# Altium schematic sheet P17_USB 3.0 HOST.SchDoc
size 420 x 297 mm
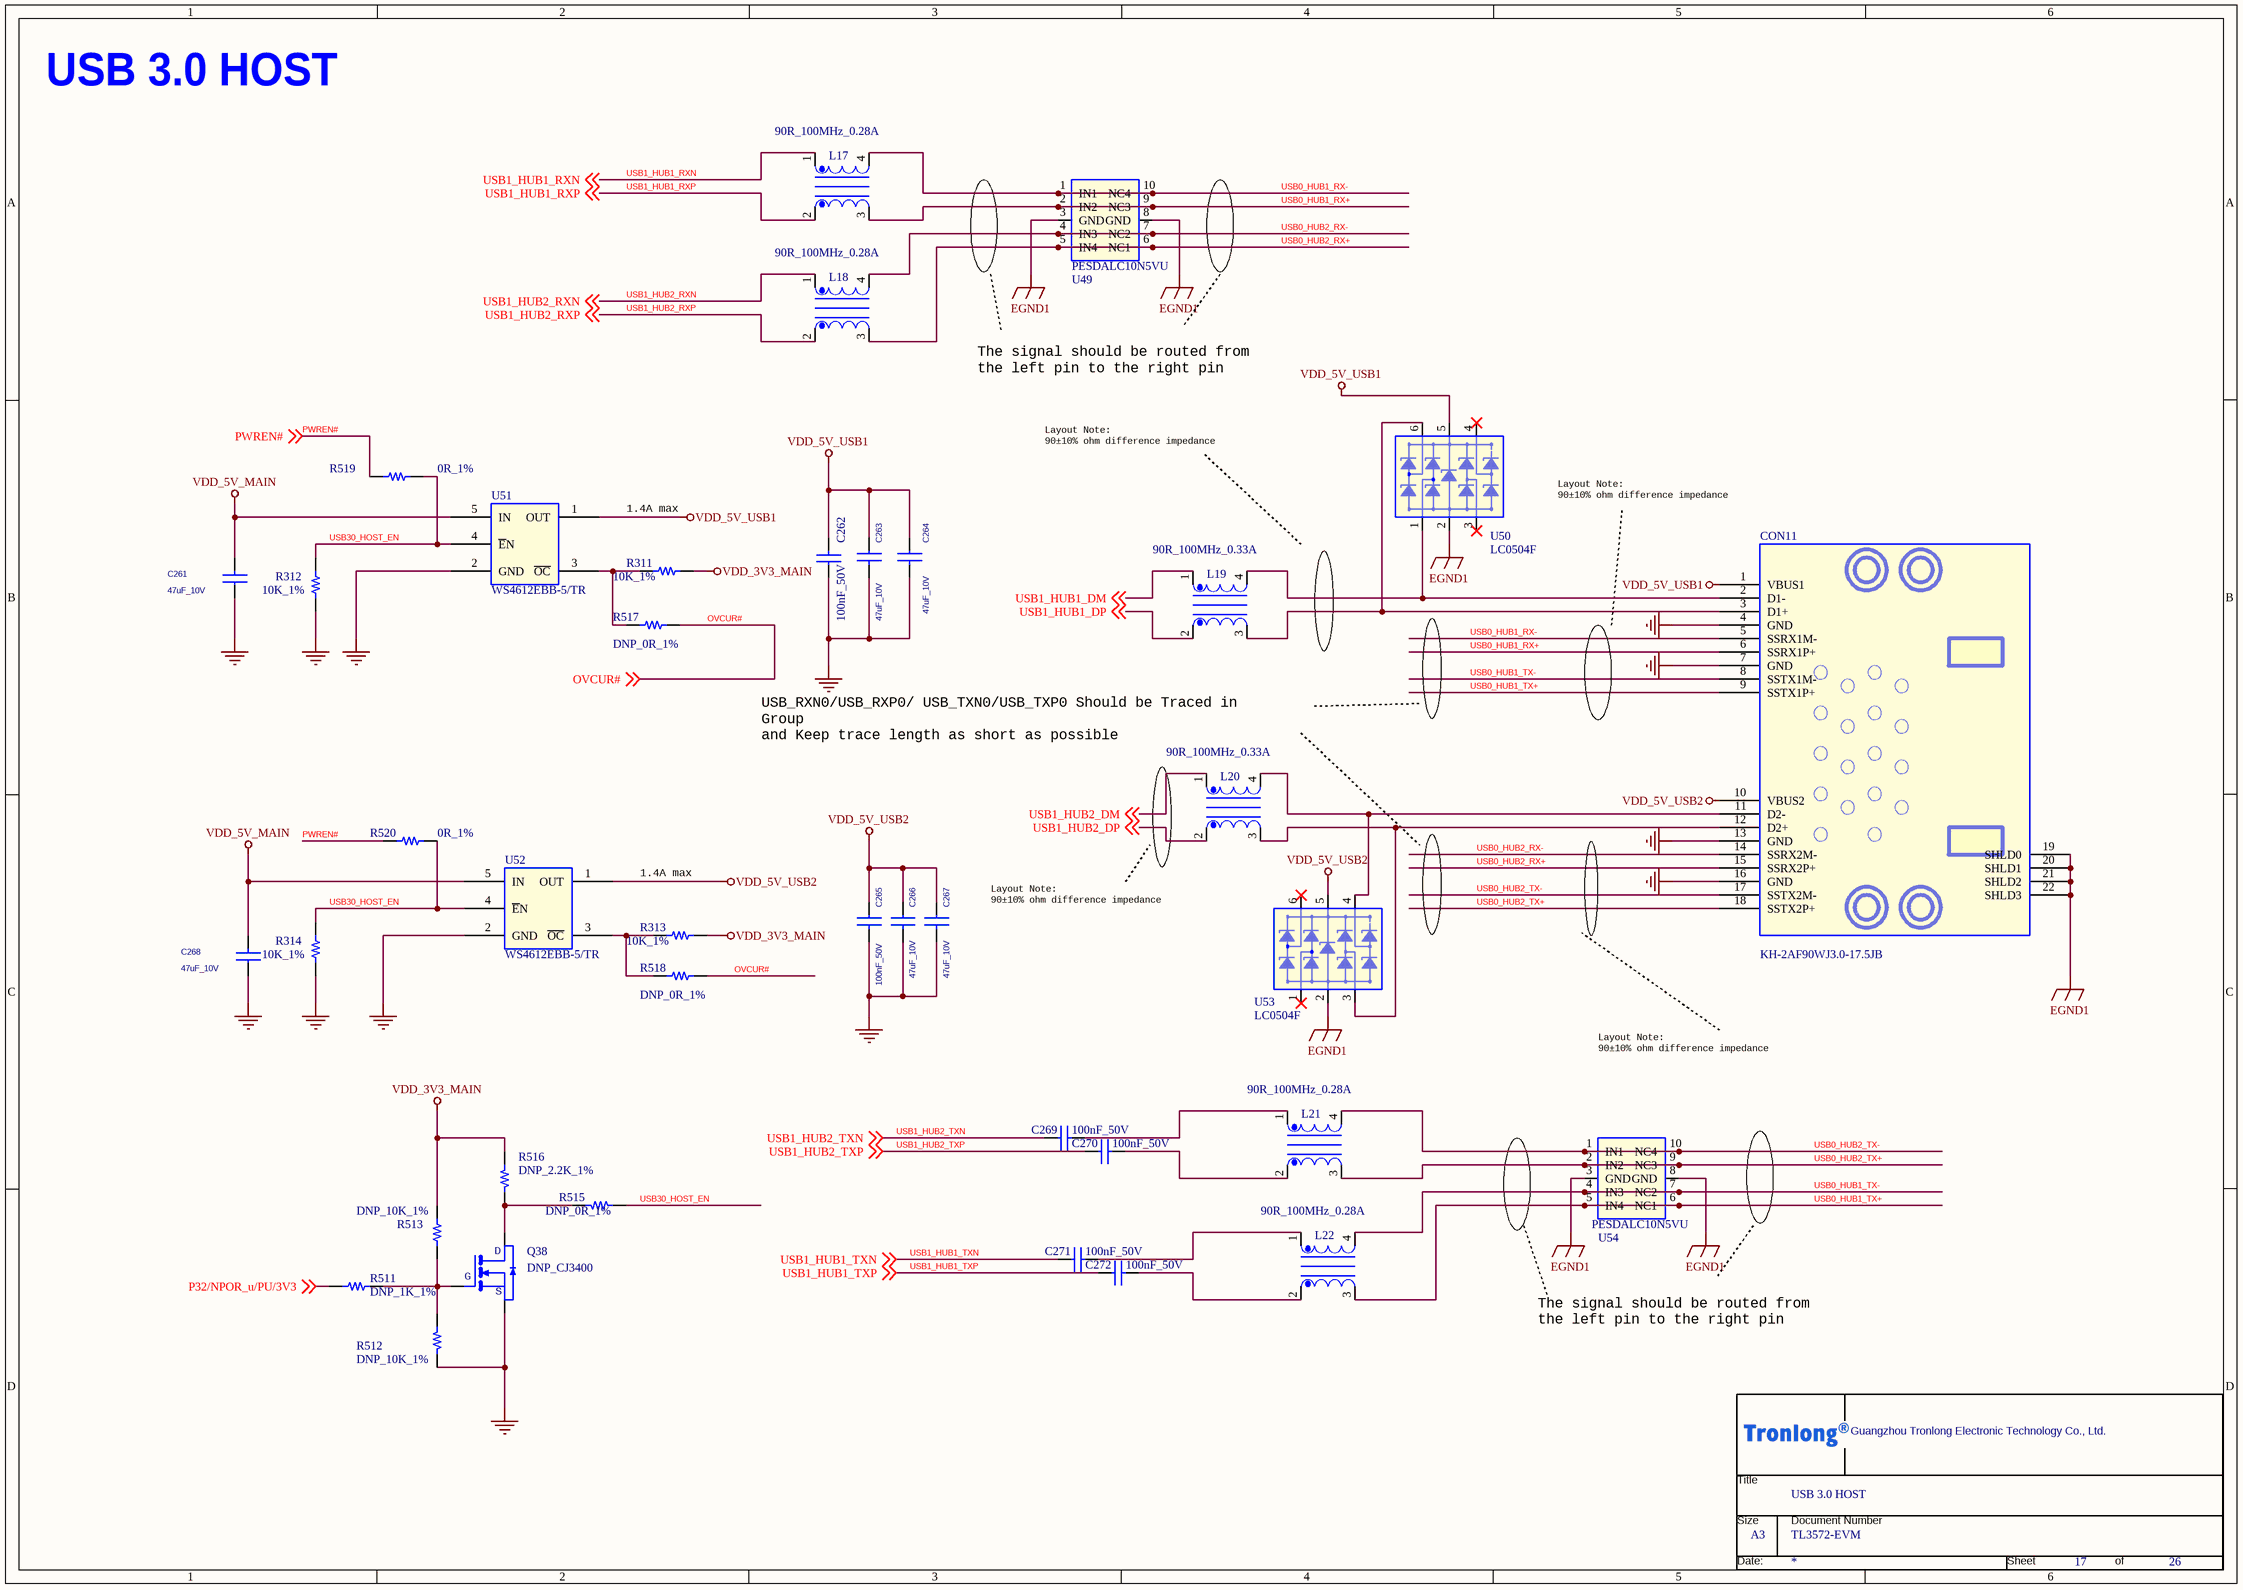
[diagram p0: P17_USB 3.0 HOST.SchDoc]

## Parts
*  Doc: TL3572-EVM  Title: USB 3.0 HOST  OrgName: Guangzhou Tronlong Electronic Technology Co., Ltd.  Page Size: A3  Page Number: 17  Page Count: 26  (hidden comment: Tronlong_TITTLE_20211115)  (graphical)
C261  47uF_10V  [C0805]
C262  100nF_50V  [C0402]
C263  47uF_10V  [C0805]
C264  47uF_10V  [C0805]
C265  100nF_50V  [C0402]
C266  47uF_10V  [C0805]
C267  47uF_10V  [C0805]
C268  47uF_10V  [C0805]
C269  100nF_50V  [C0402]
C270  100nF_50V  [C0402]
C271  100nF_50V  [C0402]
C272  100nF_50V  [C0402]
CON11  KH-2AF90WJ3.0-17.5JB  [con_usb30_a_dual]
L17  90R_100MHz_0.28A  [SMD-L2012M-4P]
L18  90R_100MHz_0.28A  [SMD-L2012M-4P]
L19  90R_100MHz_0.33A  [SMD-L2012M-4P]
L20  90R_100MHz_0.33A  [SMD-L2012M-4P]
L21  90R_100MHz_0.28A  [SMD-L2012M-4P]
L22  90R_100MHz_0.28A  [SMD-L2012M-4P]
Q38  DNP_CJ3400  [SOT23-3]
R311  10K_1%  [R0402]
R312  10K_1%  [R0402]
R313  10K_1%  [R0402]
R314  10K_1%  [R0402]
R511  DNP_1K_1%  [R0402]
R512  DNP_10K_1%  [R0402]
R513  DNP_10K_1%  [R0402]
R515  DNP_0R_1%  [R0402]
R516  DNP_2.2K_1%  [R0402]
R517  DNP_0R_1%  [R0402]
R518  DNP_0R_1%  [R0402]
R519  0R_1%  [R0402]
R520  0R_1%  [R0402]
U49  PESDALC10N5VU  [DFN-10-2510]
U50  LC0504F  [SOT363]
U51  WS4612EBB-5/TR  [SOT23-5]
U52  WS4612EBB-5/TR  [SOT23-5]
U53  LC0504F  [SOT363]
U54  PESDALC10N5VU  [DFN-10-2510]

## Nets
EGND1: CON11.19(SHLD0) CON11.20(SHLD1) CON11.21(SHLD2) CON11.22(SHLD3) U49.3(GND) U49.8(GND) U50.2 U53.2 U54.3(GND) U54.8(GND)
GND: C261.1 C262.1 C263.2 C264.2 C265.2 C266.2 C267.2 C268.1 CON11.4(GND) CON11.7(GND) CON11.13(GND) CON11.16(GND) Q38.2(E) R312.2 R314.2 R512.2 U51.2(GND) U52.2(GND)
VDD_3V3_MAIN: R311.1 R313.1 R513.1 R516.1
VDD_5V_MAIN: C261.2 C268.2 U51.5(IN) U52.5(IN)
VDD_5V_USB1: C262.2 C263.1 C264.1 CON11.1(VBUS1) U50.5 U51.1(OUT)
VDD_5V_USB2: C265.1 C266.1 C267.1 CON11.10(VBUS2) U52.1(OUT) U53.5
OVCUR#: R517.1 R518.1 ; off-sheet OVCUR#
P32/NPOR_u/PU/3V3: R511.1 ; off-sheet P32/NPOR_u/PU/3V3
PWREN#: R519.2 R520.2 ; off-sheet PWREN#
USB0_HUB1_RX+: CON11.6(SSRX1P+) L17.3 U49.2(IN2) U49.9(NC3)
USB0_HUB1_RX-: CON11.5(SSRX1M-) L17.4 U49.1(IN1) U49.10(NC4)
USB0_HUB1_TX+: CON11.9(SSTX1P+) L22.3 U54.5(IN4) U54.6(NC1)
USB0_HUB1_TX-: CON11.8(SSTX1M-) L22.4 U54.4(IN3) U54.7(NC2)
USB0_HUB2_RX+: CON11.15(SSRX2P+) L18.3 U49.5(IN4) U49.6(NC1)
USB0_HUB2_RX-: CON11.14(SSRX2M-) L18.4 U49.4(IN3) U49.7(NC2)
USB0_HUB2_TX+: CON11.18(SSTX2P+) L21.3 U54.2(IN2) U54.9(NC3)
USB0_HUB2_TX-: CON11.17(SSTX2M-) L21.4 U54.1(IN1) U54.10(NC4)
USB1_HUB1_DM: L19.1 ; off-sheet USB1_HUB1_DM
USB1_HUB1_DP: L19.2 ; off-sheet USB1_HUB1_DP
USB1_HUB1_RXN: L17.1 ; off-sheet USB1_HUB1_RXN
USB1_HUB1_RXP: L17.2 ; off-sheet USB1_HUB1_RXP
USB1_HUB1_TXN: C271.1 ; off-sheet USB1_HUB1_TXN
USB1_HUB1_TXP: C272.1 ; off-sheet USB1_HUB1_TXP
USB1_HUB2_DM: L20.1 ; off-sheet USB1_HUB2_DM
USB1_HUB2_DP: L20.2 ; off-sheet USB1_HUB2_DP
USB1_HUB2_RXN: L18.1 ; off-sheet USB1_HUB2_RXN
USB1_HUB2_RXP: L18.2 ; off-sheet USB1_HUB2_RXP
USB1_HUB2_TXN: C269.1 ; off-sheet USB1_HUB2_TXN
USB1_HUB2_TXP: C270.1 ; off-sheet USB1_HUB2_TXP
USB30_HOST_EN: R312.1 R314.1 R515.2 R519.1 R520.1 U51.4(~{E}N) U52.4(~{E}N)
NetC269_2: C269.2 L21.1
NetC270_2: C270.2 L21.2
NetC271_2: C271.2 L22.1
NetC272_2: C272.2 L22.2
NetCON11_2: CON11.2(D1-) L19.4 U50.1
NetCON11_3: CON11.3(D1+) L19.3 U50.6
NetCON11_11: CON11.11(D2-) L20.4 U53.4
NetCON11_12: CON11.12(D2+) L20.3 U53.3
NetQ38_1: Q38.1(B) R511.2 R512.1 R513.2
NetQ38_3: Q38.3(C) R515.1 R516.2
NetR311_2: R311.2 R517.2 U51.3(~{OC})
NetR313_2: R313.2 R518.2 U52.3(~{OC})

Not connected (* = marked no-connect by the designer): U50 3* 4*; U53 1* 6*

## Notes on the sheet
- USB 3.0 HOST
- The signal should be routed from
  the left pin to the right pin
- Layout Note:
  90±10% ohm difference impedance
- 1.4A max
- USB_RXN0/USB_RXP0/ USB_TXN0/USB_TXP0 Should be Traced in
  Group
  and Keep trace length as short as possible
- (near U53) Layout Note:
  90±10% ohm difference impedance
- (in symbol MOSFET N SOT) D; G; S
- (in symbol Tronlong_TITTLE_20211115) Title; Size; Document Number; Date:; Sheet; of

## Library data of the parts
* = Tronlong_TITTLE_20211115: RevCode: A?; Page Create Date: March  8, 1995; Page Modify Date: *
C261 = CAP NP_Dup2: 贴片陶瓷电容,47uF,20%,10V,X5R; Manufacturer PartNumber: 0805X476M100NT; Manufacturer: 广东风华高新科技股份有限公司（FH）; Manufacturer Character: 中国大陆; As-Welded: /; Operation Temperature（℃）: -55~+85(Ta); ERP Number: 005.0001.0001.00621; Eco-Label: ROHS; PCB Footprint: C0805; Part Status: 试用; Temperature: -55~125℃
C262 = CAP NP_Dup2: 贴片陶瓷电容,100nF,10%,50V,X7R; Manufacturer PartNumber: 0402B104K500NT; Manufacturer: 广东风华高新科技股份有限公司（FH）; Manufacturer Character: 中国大陆; Eco-Label: ROHS; ERP Number: 005.0001.0001.00681; Operation Temperature（℃）: -55~+125(Ta); As-Welded: /; PCB Footprint: C0402; Part Status: 试用; Temperature: -55~125℃
C263 C264 C266 = CAP NP_Dup2: 贴片陶瓷电容,47uF,20%,10V,X5R; Manufacturer Character: 中国大陆; Manufacturer: 广东风华高新科技股份有限公司（FH）; Manufacturer PartNumber: 0805X476M100NT; As-Welded: /; Operation Temperature（℃）: -55~+85(Ta); ERP Number: 005.0001.0001.00621; Eco-Label: ROHS; PCB Footprint: C0805; Part Status: 试用; Temperature: -55~125℃
C265 C267 = CAP NP_Dup2: 贴片陶瓷电容,47uF,20%,10V,X5R; Manufacturer PartNumber: 0805X476M100NT; Manufacturer: 广东风华高新科技股份有限公司（FH）; Manufacturer Character: 中国大陆; Eco-Label: ROHS; ERP Number: 005.0001.0001.00621; Operation Temperature（℃）: -55~+85(Ta); As-Welded: /; Temperature: -55~125℃; Part Status: 试用
  C265: PCB Footprint: C0402
  C267: PCB Footprint: C0805
C268 = CAP NP_Dup2: 贴片陶瓷电容,47uF,20%,10V,X5R; Manufacturer Character: 中国大陆; Manufacturer: 广东风华高新科技股份有限公司（FH）; Manufacturer PartNumber: 0805X476M100NT; Eco-Label: ROHS; ERP Number: 005.0001.0001.00621; Operation Temperature（℃）: -55~+85(Ta); As-Welded: /; PCB Footprint: C0805; Temperature: -55~125℃; Part Status: 试用
C269 C270 = CAP NP_Dup2: 贴片陶瓷电容,100nF,10%,50V,X7R; Manufacturer Character: 中国大陆; Manufacturer PartNumber: 0402B104K500NT; Manufacturer: 广东风华高新科技股份有限公司（FH）; As-Welded: /; Operation Temperature（℃）: -55~+125(Ta); ERP Number: 005.0001.0001.00681; Eco-Label: ROHS; Part Status: 试用; PCB Footprint: C0402
C271 C272 = CAP NP_Dup2: 贴片陶瓷电容,100nF,10%,50V,X7R; Manufacturer: 广东风华高新科技股份有限公司（FH）; Manufacturer PartNumber: 0402B104K500NT; Manufacturer Character: 中国大陆; Eco-Label: ROHS; ERP Number: 005.0001.0001.00681; Operation Temperature（℃）: -55~+125(Ta); As-Welded: /; Part Status: 试用; PCB Footprint: C0402
CON11 = U225-18XN-1VV155-S1: USB A型座,USB3.0,18P,90度,双层,母座,插件; Manufacturer: 深圳市金航标电子有限公司(kinghelm); Manufacturer Character: 中国大陆; ERP Number: 005.0001.0003.00696; Eco-Label: ROHS; As-Welded: /; Operation Temperature（℃）: -25~+85(Ta); PCB Footprint: con_usb30_a_dual; Manufacturer PartNumber: KH-2AF90WJ3.0-17.5JB; Part Status: 测评
L17 L18 L21 L22 = TFR_AXA_A_1: 贴片共模电感,400mΩ,0.28A,20V,90Ω@100MHz; Manufacturer PartNumber: SDCW2012U-2-900TF; Manufacturer: 深圳顺络电子股份有限公司（Sunlord）; Manufacturer Character: 中国大陆; ERP Number: 005.0001.0006.00186; Operation Temperature（℃）: -40~+85(Ta); As-Welded: /; Eco-Label: ROHS; Part Status: 试用; PCB Footprint: SMD-L2012M-4P
L19 L20 = TFR_AXA_A_1: 贴片共模电感,350mΩ,0.33A,50V,90Ω@100MHz; Manufacturer Character: 中国大陆; Manufacturer: 深圳顺络电子股份有限公司（Sunlord）; Manufacturer PartNumber: SDCW2012-2-900TF; As-Welded: /; Operation Temperature（℃）: -40~+85(Ta); ERP Number: 005.0001.0006.00172; Eco-Label: ROHS; PCB Footprint: SMD-L2012M-4P; Part Status: 测评
Q38 = MOSFET N SOT: MOSFET,N沟道,VDSS=30V,VGSS=±12V,ID=5.8A,PD=0.35W,VGS(th)=1.4V; Manufacturer: 江苏长晶科技股份有限公司（JSCJ）; Manufacturer PartNumber: CJ3400; Manufacturer Character: 中国大陆; Eco-Label: ROHS; ERP Number: 005.0001.0009.00027; Operation Temperature（℃）: -55~+150(Tj); ROOM: DSP_LED; As-Welded: DNP; Temperature: -55~150℃; Part Status: 优选; PCB Footprint: SOT23-3
R311 R313 = Resistor_Dup3: 贴片电阻,10K,±1%,1/16W; Manufacturer Character: 中国大陆; Manufacturer PartNumber: RC-02K1002FT; Manufacturer: 广东风华高新科技股份有限公司（FH）; CLASS: DISCRETE; As-Welded: /; room: DRDUSB; Operation Temperature（℃）: -55~+125(Ta); ERP Number: 005.0001.0002.01326; Eco-Label: ROHS; PCB Footprint: R0402; Part Status: 优选; Temperature: -55~155℃
R312 = Resistor_Dup3: 贴片电阻,10K,±1%,1/16W; Manufacturer Character: 中国大陆; Manufacturer PartNumber: RC-02K1002FT; Manufacturer: 广东风华高新科技股份有限公司（FH）; CLASS: DISCRETE; As-Welded: /; room: USB3.0; Operation Temperature（℃）: -55~+125(Ta); ERP Number: 005.0001.0002.01326; Eco-Label: ROHS; PCB Footprint: R0402; Part Status: 优选; Temperature: -55~155℃
R314 = Resistor_Dup3: 贴片电阻,10K,±1%,1/16W; Manufacturer PartNumber: RC-02K1002FT; Manufacturer: 广东风华高新科技股份有限公司（FH）; Manufacturer Character: 中国大陆; CLASS: DISCRETE; As-Welded: /; Operation Temperature（℃）: -55~+125(Ta); room: USB3.0; ERP Number: 005.0001.0002.01326; Eco-Label: ROHS; PCB Footprint: R0402; Part Status: 优选; Temperature: -55~155℃
R511 = Resistor_Dup3: 贴片电阻,1K,±1%,1/16W; Manufacturer: 广东风华高新科技股份有限公司（FH）; Manufacturer Character: 中国大陆; Mistral Part No: 110009031036-R; Mfr_name: PANASONIC-ECG; Mfr_part_number: ERJ-2RNF6981V; Part_type: RESISTORS\FIXED; Manufacturer PartNumber: RC-02K1001FT; CLASS: DISCRETE; Eco-Label: ROHS; ERP Number: 005.0001.0002.01327; Operation Temperature（℃）: -55~+125(Ta); As-Welded: DNP; Project: TELEMETRY ENCODER; Package: 0402; Distributor_name: NA; Distributor_part_number: NA; Height: 0.40MM; ERP PCB Footprint: R0402; Part Status: 优选; PCB Footprint: R0402
R512 = Resistor_Dup4: 贴片电阻,10K,±1%,1/16W; Manufacturer: 广东风华高新科技股份有限公司（FH）; Manufacturer PartNumber: RC-02K1002FT; Manufacturer Character: 中国大陆; CLASS: DISCRETE; ERP Number: 005.0001.0002.01326; Operation Temperature（℃）: -55~+125(Ta); As-Welded: DNP; Eco-Label: ROHS; Part Status: 优选; ERP PCB Footprint: R0402; PCB Footprint: R0402
R513 = Resistor_Dup3: 贴片电阻,10K,±1%,1/16W; Manufacturer Character: 中国大陆; Manufacturer PartNumber: RC-02K1002FT; Manufacturer: 广东风华高新科技股份有限公司（FH）; CLASS: DISCRETE; Eco-Label: ROHS; ERP Number: 005.0001.0002.01326; Operation Temperature（℃）: -55~+125(Ta); As-Welded: DNP; Temperature: –55~155℃; ERP PCB Footprint: R0402; Part Status: 优选; PCB Footprint: R0402
R515 = Resistor_Dup3: 贴片电阻,0R,±1%,1/16W; Manufacturer Character: 中国大陆; Manufacturer PartNumber: RC-02000FT; Manufacturer: 广东风华高新科技股份有限公司（FH）; CLASS: DISCRETE; As-Welded: DNP; Operation Temperature（℃）: -55~+155(Ta); ERP Number: 005.0001.0002.00938; Eco-Label: ROHS; Temperature: –55~155℃; ERP PCB Footprint: R0402; Part Status: 优选; PCB Footprint: R0402
R516 = Resistor_Dup4: 贴片电阻,2.2K,±1%,1/16W; Manufacturer: 广东风华高新科技股份有限公司（FH）; Manufacturer PartNumber: RC-02K2201FT; Manufacturer Character: 中国大陆; CLASS: DISCRETE; Operation Temperature（℃）: -55~+125(Ta); As-Welded: DNP; ERP Number: 005.0001.0002.01317; Eco-Label: ROHS; Temperature: -55~155℃; Part Status: 试用; PCB Footprint: R0402
R517 R518 = Resistor_Dup3: 贴片电阻,0R,±1%,1/16W; Manufacturer: 广东风华高新科技股份有限公司（FH）; Manufacturer PartNumber: RC-02000FT; Manufacturer Character: 中国大陆; CLASS: DISCRETE; Eco-Label: ROHS; As-Welded: DNP; Operation Temperature（℃）: -55~+155(Ta); ERP Number: 005.0001.0002.00938; PCB Footprint: R0402; Part Status: 优选
R519 = Resistor_Dup3: 贴片电阻,0R,±1%,1/16W; Manufacturer Character: 中国大陆; Manufacturer PartNumber: RC-02000FT; Manufacturer: 广东风华高新科技股份有限公司（FH）; CLASS: DISCRETE; ERP Number: 005.0001.0002.00938; Operation Temperature（℃）: -55~+155(Ta); As-Welded: /; Eco-Label: ROHS; PCB Footprint: R0402; Part Status: 优选
R520 = Resistor_Dup3: 贴片电阻,0R,±1%,1/16W; Manufacturer: 广东风华高新科技股份有限公司（FH）; Manufacturer PartNumber: RC-02000FT; Manufacturer Character: 中国大陆; CLASS: DISCRETE; Eco-Label: ROHS; As-Welded: /; Operation Temperature（℃）: -55~+155(Ta); ERP Number: 005.0001.0002.00938; PCB Footprint: R0402; Part Status: 优选
U49 = SU099PGTR: ESD二极管,VRWM=5V,VBR=6V,四组,单向,15KV,30KV; Manufacturer: 上海芯导电子科技股份有限公司（Prisemi）; Manufacturer Character: 中国大陆; As-Welded: /; Operation Temperature（℃）: -55~+150(Tj); ERP Number: 005.0001.0004.00739; Eco-Label: ROHS; Temperature: -55~150; Manufacturer PartNumber: PESDALC10N5VU; Part Status: 优选; PCB Footprint: DFN-10-2510
U50 U53 = PRTR5V0U4Y_0: ESD二极管,VRWM=5V,VBR=6V,四组,单向,8KV,15KV; Manufacturer: 上海雷卯电子科技有限公司（Leiditech）; Manufacturer Character: 中国大陆; As-Welded: /; room: SD; Operation Temperature（℃）: -55~+125(Tj); ERP Number: 005.0001.0017.00061; Eco-Label: ROHS; PCB Footprint: SOT363; Part Status: 优选; Temperature: -55~125℃; Manufacturer PartNumber: LC0504F; Manufacturer Part Number: PRTR5V0U4Y
U51 U52 = TPS2041BDGN_0: 限流配电开关,2.5V~5.5V,1.4A; Manufacturer Character: 中国大陆; Manufacturer: 上海韦尔半导体股份有限公司（WILLSEMI）; Eco-Label: ROHS; ERP Number: 005.0001.0004.00705; room: DRDUSB; Operation Temperature（℃）: -40~+85(Ta); As-Welded: /; PCB Footprint: SOT23-5; Manufacturer PartNumber: WS4612EBB-5/TR; Temperature: -40~85℃; Part Status: 试用
U54 = SU099PGTR: ESD二极管,VRWM=5V,VBR=6V,四组,单向,15KV,30KV; Manufacturer Character: 中国大陆; Manufacturer: 上海芯导电子科技股份有限公司（Prisemi）; Eco-Label: ROHS; ERP Number: 005.0001.0004.00739; Operation Temperature（℃）: -55~+150(Tj); As-Welded: /; Manufacturer PartNumber: PESDALC10N5VU; Temperature: -55~150; Part Status: 优选; PCB Footprint: DFN-10-2510